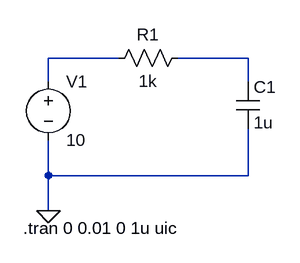
[diagram p0: schematic Draft2.asc]
Draft2.asc, the LTspice schematic file:
Version 4
SHEET 1 880 680
WIRE 48 96 -48 96
WIRE 224 96 128 96
WIRE -48 128 -48 96
WIRE 224 128 224 96
WIRE -48 256 -48 208
WIRE 224 256 224 192
WIRE 224 256 -48 256
WIRE -48 304 -48 256
FLAG -48 304 0
SYMBOL voltage -48 112 R0
WINDOW 123 0 0 Left 0
WINDOW 39 0 0 Left 0
SYMATTR InstName V1
SYMATTR Value 10
SYMBOL res 144 80 R90
WINDOW 0 0 56 VBottom 2
WINDOW 3 32 56 VTop 2
SYMATTR InstName R1
SYMATTR Value 1k
SYMBOL cap 208 128 R0
SYMATTR InstName C1
SYMATTR Value 1u
TEXT -82 328 Left 2 !.tran 0 0.01 0 1u uic

The netlist it stands for:
* Draft2.asc
V1 N001 0 10
R1 N002 N001 1k
C1 N002 0 1u
.tran 0 0.01 0 1u uic
.backanno
.end